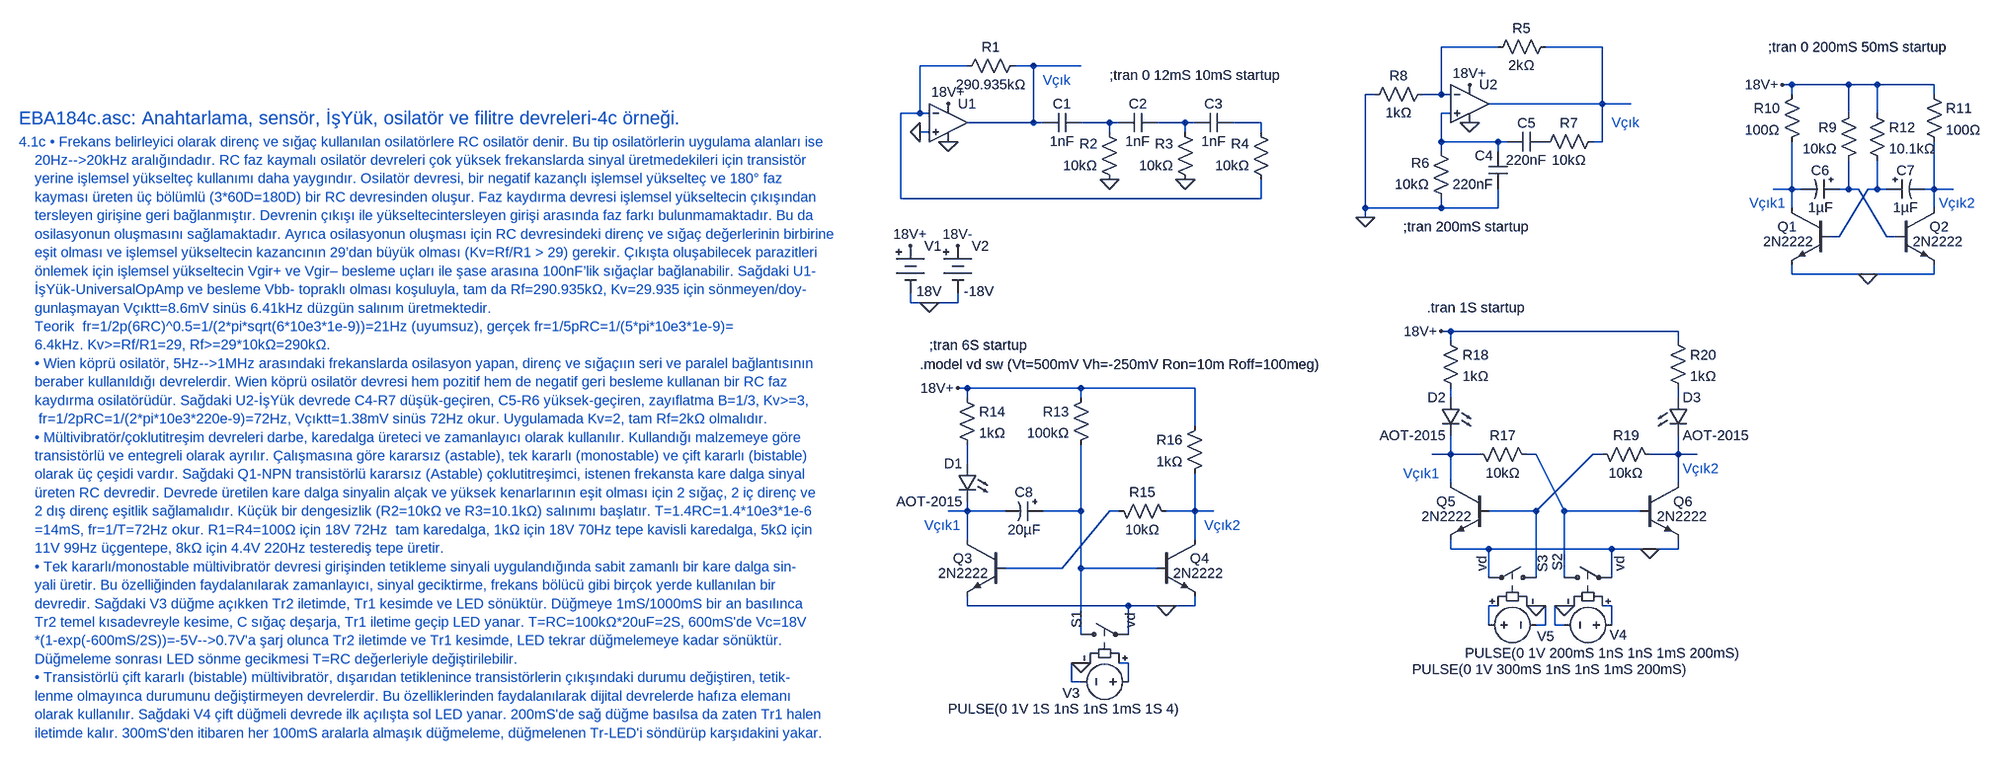
[diagram p0: schematic EBA184c.asc]
EBA184c.asc, the LTspice schematic file:
Version 4
SHEET 1 7064 4332
WIRE 2448 -64 2352 -64
WIRE 2624 -64 2528 -64
WIRE 1552 -32 1472 -32
WIRE 1664 -32 1632 -32
WIRE 1744 -32 1664 -32
WIRE 2944 0 2928 0
WIRE 3040 0 2944 0
WIRE 3088 0 3040 0
WIRE 3184 0 3088 0
WIRE 2240 16 2224 16
WIRE 2352 16 2352 -64
WIRE 2352 16 2320 16
WIRE 2368 16 2352 16
WIRE 2944 16 2944 0
WIRE 3184 16 3184 0
WIRE 2624 32 2624 -64
WIRE 2624 32 2432 32
WIRE 2672 32 2624 32
WIRE 1472 48 1472 -32
WIRE 1472 48 1440 48
WIRE 1488 48 1472 48
WIRE 2368 48 2352 48
WIRE 3040 48 3040 0
WIRE 3088 48 3088 0
WIRE 1664 64 1664 -32
WIRE 1664 64 1552 64
WIRE 1680 64 1664 64
WIRE 1792 64 1744 64
WIRE 1808 64 1792 64
WIRE 1920 64 1872 64
WIRE 1936 64 1920 64
WIRE 2048 64 2000 64
WIRE 1488 80 1472 80
WIRE 1792 80 1792 64
WIRE 1920 80 1920 64
WIRE 2048 80 2048 64
WIRE 2352 96 2352 48
WIRE 2448 96 2352 96
WIRE 2464 96 2448 96
WIRE 2624 96 2624 32
WIRE 2624 96 2608 96
WIRE 2352 112 2352 96
WIRE 2448 112 2448 96
WIRE 2944 176 2944 96
WIRE 2944 176 2912 176
WIRE 2960 176 2944 176
WIRE 3040 176 3040 128
WIRE 3040 176 3024 176
WIRE 3056 176 3040 176
WIRE 3088 176 3088 128
WIRE 3088 176 3072 176
WIRE 3104 176 3088 176
WIRE 3184 176 3184 96
WIRE 3184 176 3168 176
WIRE 3216 176 3184 176
WIRE 1440 192 1440 48
WIRE 2048 192 2048 160
WIRE 2048 192 1440 192
WIRE 2224 208 2224 16
WIRE 2352 208 2352 192
WIRE 2352 208 2224 208
WIRE 2448 208 2448 176
WIRE 2448 208 2352 208
WIRE 2944 208 2944 176
WIRE 3184 208 3184 176
WIRE 2224 224 2224 208
WIRE 3024 256 3072 176
WIRE 3024 256 3008 256
WIRE 3104 256 3056 176
WIRE 3120 256 3104 256
WIRE 2944 320 2944 304
WIRE 3072 320 2944 320
WIRE 3184 320 3184 304
WIRE 3184 320 3072 320
WIRE 1456 368 1456 352
WIRE 1488 368 1456 368
WIRE 1536 368 1536 352
WIRE 1536 368 1488 368
WIRE 2368 416 2352 416
WIRE 2752 416 2368 416
WIRE 2368 432 2368 416
WIRE 2752 432 2752 416
WIRE 1552 512 1536 512
WIRE 1744 512 1552 512
WIRE 1936 512 1744 512
WIRE 1552 528 1552 512
WIRE 1744 528 1744 512
WIRE 2368 528 2368 512
WIRE 2752 528 2752 512
WIRE 1936 576 1936 512
WIRE 2368 624 2368 592
WIRE 2368 624 2336 624
WIRE 2416 624 2368 624
WIRE 2512 624 2496 624
WIRE 2624 624 2608 624
WIRE 2752 624 2752 592
WIRE 2752 624 2704 624
WIRE 2784 624 2752 624
WIRE 1552 640 1552 608
WIRE 2368 672 2368 624
WIRE 2752 672 2752 624
WIRE 1552 720 1552 704
WIRE 1552 720 1520 720
WIRE 1616 720 1552 720
WIRE 1744 720 1744 608
WIRE 1744 720 1680 720
WIRE 1808 720 1792 720
WIRE 1936 720 1936 656
WIRE 1936 720 1888 720
WIRE 1968 720 1936 720
WIRE 2512 720 2608 624
WIRE 2512 720 2432 720
WIRE 2560 720 2512 624
WIRE 2688 720 2560 720
WIRE 1552 768 1552 720
WIRE 1936 768 1936 720
WIRE 2368 784 2368 768
WIRE 2432 784 2368 784
WIRE 2640 784 2432 784
WIRE 2704 784 2640 784
WIRE 2752 784 2752 768
WIRE 2752 784 2704 784
WIRE 1712 816 1792 720
WIRE 1712 816 1616 816
WIRE 1744 816 1744 720
WIRE 1872 816 1744 816
WIRE 2432 832 2432 784
WIRE 2512 832 2512 720
WIRE 2560 832 2560 720
WIRE 2640 832 2640 784
WIRE 1552 880 1552 864
WIRE 1824 880 1552 880
WIRE 1888 880 1824 880
WIRE 1936 880 1936 864
WIRE 1936 880 1888 880
WIRE 2448 880 2432 880
WIRE 2512 880 2496 880
WIRE 2528 880 2512 880
WIRE 2560 880 2544 880
WIRE 2576 880 2560 880
WIRE 2640 880 2624 880
WIRE 2432 912 2432 880
WIRE 2528 912 2528 880
WIRE 2528 912 2512 912
WIRE 2544 912 2544 880
WIRE 2560 912 2544 912
WIRE 2640 912 2640 880
WIRE 1744 928 1744 816
WIRE 1824 928 1824 880
WIRE 1744 976 1728 976
WIRE 1760 976 1744 976
WIRE 1824 976 1808 976
WIRE 1728 1008 1728 976
WIRE 1744 1008 1728 1008
WIRE 1824 1008 1824 976
FLAG 1456 272 18V+
FLAG 1488 368 0
FLAG 1536 272 18V-
FLAG 1520 32 18V+
FLAG 1472 80 0
FLAG 1920 160 0
FLAG 1792 160 0
FLAG 1520 96 0
FLAG 2400 0 18V+
FLAG 2224 224 0
FLAG 2400 64 0
FLAG 3072 320 0
FLAG 2928 0 18V+
FLAG 1744 976 0
FLAG 1888 880 0
FLAG 1536 512 18V+
FLAG 2560 880 0
FLAG 2704 784 0
FLAG 2512 880 0
FLAG 2352 416 18V+
SYMBOL Misc\\battery 1456 256 R0
WINDOW 3 10 93 Left 2
SYMATTR Value 18V
SYMATTR InstName V1
SYMBOL Misc\\battery 1536 256 R0
WINDOW 3 10 93 Left 2
SYMATTR Value -18V
SYMATTR InstName V2
SYMBOL res 1648 -48 R90
WINDOW 0 0 56 VBottom 2
WINDOW 3 32 56 VTop 2
SYMATTR InstName R1
SYMATTR Value 290.935kΩ
SYMBOL cap 1744 48 R90
WINDOW 0 0 32 VBottom 2
WINDOW 3 32 32 VTop 2
SYMATTR InstName C1
SYMATTR Value 1nF
SYMBOL res 1808 176 R180
WINDOW 0 36 76 Left 2
WINDOW 3 36 40 Left 2
SYMATTR InstName R2
SYMATTR Value 10kΩ
SYMBOL cap 1872 48 R90
WINDOW 0 0 32 VBottom 2
WINDOW 3 32 32 VTop 2
SYMATTR InstName C2
SYMATTR Value 1nF
SYMBOL res 1936 176 R180
WINDOW 0 36 76 Left 2
WINDOW 3 36 40 Left 2
SYMATTR InstName R3
SYMATTR Value 10kΩ
SYMBOL cap 2000 48 R90
WINDOW 0 0 32 VBottom 2
WINDOW 3 32 32 VTop 2
SYMATTR InstName C3
SYMATTR Value 1nF
SYMBOL res 2064 176 R180
WINDOW 0 36 76 Left 2
WINDOW 3 36 40 Left 2
SYMATTR InstName R4
SYMATTR Value 10kΩ
SYMBOL OpAmps\\UniversalOpAmp 1520 64 R0
SYMATTR InstName U1
SYMBOL res 2544 -80 R90
WINDOW 0 0 56 VBottom 2
WINDOW 3 32 56 VTop 2
SYMATTR InstName R5
SYMATTR Value 2kΩ
SYMBOL cap 2464 176 R180
WINDOW 0 24 56 Left 2
WINDOW 3 24 8 Left 2
SYMATTR InstName C4
SYMATTR Value 220nF
SYMBOL res 2368 208 R180
WINDOW 0 36 76 Left 2
WINDOW 3 36 40 Left 2
SYMATTR InstName R6
SYMATTR Value 10kΩ
SYMBOL cap 2528 80 R90
WINDOW 0 0 32 VBottom 2
WINDOW 3 32 32 VTop 2
SYMATTR InstName C5
SYMATTR Value 220nF
SYMBOL res 2512 112 R270
WINDOW 0 32 56 VTop 2
WINDOW 3 0 56 VBottom 2
SYMATTR InstName R7
SYMATTR Value 10kΩ
SYMBOL res 2224 32 R270
WINDOW 0 32 56 VTop 2
WINDOW 3 0 56 VBottom 2
SYMATTR InstName R8
SYMATTR Value 1kΩ
SYMBOL OpAmps\\UniversalOpAmp 2400 32 R0
SYMATTR InstName U2
SYMBOL npn 3008 208 M0
WINDOW 3 28 57 Left 2
SYMATTR Value 2N2222
SYMATTR InstName Q1
SYMBOL res 3056 32 M0
SYMATTR InstName R9
SYMATTR Value 10kΩ
SYMBOL polcap 3024 160 R90
WINDOW 0 0 32 VBottom 2
WINDOW 3 32 32 VTop 2
SYMATTR InstName C6
SYMATTR Value 1µF
SYMBOL res 2960 0 M0
SYMATTR InstName R10
SYMATTR Value 100Ω
SYMBOL npn 3120 208 R0
WINDOW 3 28 57 Left 2
SYMATTR Value 2N2222
SYMATTR InstName Q2
SYMBOL res 3168 0 R0
SYMATTR InstName R11
SYMATTR Value 100Ω
SYMBOL polcap 3104 160 M90
WINDOW 0 0 32 VBottom 2
WINDOW 3 32 32 VTop 2
SYMATTR InstName C7
SYMATTR Value 1µF
SYMBOL res 3072 32 R0
SYMATTR InstName R12
SYMATTR Value 10.1kΩ
SYMBOL npn 1616 768 M0
WINDOW 3 28 57 Left 2
SYMATTR Value 2N2222
SYMATTR InstName Q3
SYMBOL LED 1568 640 M0
SYMATTR InstName D1
SYMATTR Value AOT-2015
SYMATTR Description Diode
SYMATTR Type diode
SYMBOL res 1760 512 M0
SYMATTR InstName R13
SYMATTR Value 100kΩ
SYMBOL res 1536 512 R0
SYMATTR InstName R14
SYMATTR Value 1kΩ
SYMBOL npn 1872 768 R0
WINDOW 3 28 57 Left 2
SYMATTR Value 2N2222
SYMATTR InstName Q4
SYMBOL res 1904 736 M270
WINDOW 0 32 56 VTop 2
WINDOW 3 0 56 VBottom 2
SYMATTR InstName R15
SYMATTR Value 10kΩ
SYMBOL res 1952 560 M0
SYMATTR InstName R16
SYMATTR Value 1kΩ
SYMBOL sw 1728 928 R270
WINDOW 0 11 9 Left 2
WINDOW 3 10 100 Left 2
SYMATTR InstName S1
SYMATTR Value vd
SYMBOL voltage 1840 1008 R90
WINDOW 0 19 98 VRight 2
WINDOW 3 46 -71 VRight 2
WINDOW 123 0 0 Left 0
WINDOW 39 0 0 Left 0
SYMATTR InstName V3
SYMATTR Value PULSE(0 1V 1S 1nS 1nS 1mS 1S 4)
SYMBOL polcap 1680 704 R90
WINDOW 0 0 32 VBottom 2
WINDOW 3 32 32 VTop 2
SYMATTR InstName C8
SYMATTR Value 20µF
SYMBOL npn 2432 672 M0
WINDOW 3 28 57 Left 2
SYMATTR Value 2N2222
SYMATTR InstName Q5
SYMBOL LED 2384 528 M0
SYMATTR InstName D2
SYMATTR Value AOT-2015
SYMATTR Description Diode
SYMATTR Type diode
SYMBOL res 2512 640 M270
WINDOW 0 32 56 VTop 2
WINDOW 3 0 56 VBottom 2
SYMATTR InstName R17
SYMATTR Value 10kΩ
SYMBOL res 2352 416 R0
SYMATTR InstName R18
SYMATTR Value 1kΩ
SYMBOL npn 2688 672 R0
WINDOW 3 28 57 Left 2
SYMATTR Value 2N2222
SYMATTR InstName Q6
SYMBOL res 2720 640 M270
WINDOW 0 32 56 VTop 2
WINDOW 3 0 56 VBottom 2
SYMATTR InstName R19
SYMATTR Value 10kΩ
SYMBOL sw 2544 832 R270
WINDOW 0 11 5 Left 2
WINDOW 3 10 110 Left 2
SYMATTR InstName S2
SYMATTR Value vd
SYMBOL voltage 2656 912 R90
WINDOW 0 17 -10 VRight 2
WINDOW 3 48 -202 VRight 2
WINDOW 123 0 0 Left 0
WINDOW 39 0 0 Left 0
SYMATTR InstName V4
SYMATTR Value PULSE(0 1V 200mS 1nS 1nS 1mS 200mS)
SYMBOL LED 2736 528 R0
SYMATTR InstName D3
SYMATTR Value AOT-2015
SYMATTR Description Diode
SYMATTR Type diode
SYMBOL res 2736 416 R0
SYMATTR InstName R20
SYMATTR Value 1kΩ
SYMBOL sw 2528 832 M270
WINDOW 0 9 4 Left 2
WINDOW 3 10 107 Left 2
SYMATTR InstName S3
SYMATTR Value vd
SYMBOL voltage 2416 912 M90
WINDOW 0 19 98 VRight 2
WINDOW 3 75 -113 VRight 2
WINDOW 123 0 0 Left 0
WINDOW 39 0 0 Left 0
SYMATTR InstName V5
SYMATTR Value PULSE(0 1V 300mS 1nS 1nS 1mS 200mS)
TEXT -232 56 Left 3 ;EBA184c.asc: Anahtarlama, sensör, İşYük, osilatör ve filitre devreleri-4c örneği.
TEXT -232 96 Left 2 ;4.1c • Frekans belirleyici olarak direnç ve sığaç kullanılan osilatörlere RC osilatör denir. Bu tip osilatörlerin uygulama alanları ise\n    20Hz-->20kHz aralığındadır. RC faz kaymalı osilatör devreleri çok yüksek frekanslarda sinyal üretmedekileri için transistör \n    yerine işlemsel yükselteç kullanımı daha yaygındır. Osilatör devresi, bir negatif kazançlı işlemsel yükselteç ve 180° faz \n    kayması üreten üç bölümlü (3*60D=180D) bir RC devresinden oluşur. Faz kaydırma devresi işlemsel yükseltecin çıkışından \n    tersleyen girişine geri bağlanmıştır. Devrenin çıkışı ile yükseltecintersleyen girişi arasında faz farkı bulunmamaktadır. Bu da \n    osilasyonun oluşmasını sağlamaktadır. Ayrıca osilasyonun oluşması için RC devresindeki direnç ve sığaç değerlerinin birbirine\n    eşit olması ve işlemsel yükseltecin kazancının 29’dan büyük olması (Kv=Rf/R1 > 29) gerekir. Çıkışta oluşabilecek parazitleri\n    önlemek için işlemsel yükseltecin Vgir+ ve Vgir– besleme uçları ile şase arasına 100nF’lik sığaçlar bağlanabilir. Sağdaki U1-\n    İşYük-UniversalOpAmp ve besleme Vbb- topraklı olması koşuluyla, tam da Rf=290.935kΩ, Kv=29.935 için sönmeyen/doy-\n    gunlaşmayan Vçıktt=8.6mV sinüs 6.41kHz düzgün salınım üretmektedir.\n    Teorik  fr=1/2p(6RC)^0.5=1/(2*pi*sqrt(6*10e3*1e-9))=21Hz (uyumsuz), gerçek fr=1/5pRC=1/(5*pi*10e3*1e-9)=\n    6.4kHz. Kv>=Rf/R1=29, Rf>=29*10kΩ=290kΩ.\n    • Wien köprü osilatör, 5Hz-->1MHz arasındaki frekanslarda osilasyon yapan, direnç ve sığaçıın seri ve paralel bağlantısının \n    beraber kullanıldığı devrelerdir. Wien köprü osilatör devresi hem pozitif hem de negatif geri besleme kullanan bir RC faz\n    kaydırma osilatörüdür. Sağdaki U2-İşYük devrede C4-R7 düşük-geçiren, C5-R6 yüksek-geçiren, zayıflatma B=1/3, Kv>=3,\n     fr=1/2pRC=1/(2*pi*10e3*220e-9)=72Hz, Vçıktt=1.38mV sinüs 72Hz okur. Uygulamada Kv=2, tam Rf=2kΩ olmalıdır.\n    • Mültivibratör/çoklutitreşim devreleri darbe, karedalga üreteci ve zamanlayıcı olarak kullanılır. Kullandığı malzemeye göre \n    transistörlü ve entegreli olarak ayrılır. Çalışmasına göre kararsız (astable), tek kararlı (monostable) ve çift kararlı (bistable) \n    olarak üç çeşidi vardır. Sağdaki Q1-NPN transistörlü kararsız (Astable) çoklutitreşimci, istenen frekansta kare dalga sinyal \n    üreten RC devredir. Devrede üretilen kare dalga sinyalin alçak ve yüksek kenarlarının eşit olması için 2 sığaç, 2 iç direnç ve\n    2 dış direnç eşitlik sağlamalıdır. Küçük bir dengesizlik (R2=10kΩ ve R3=10.1kΩ) salınımı başlatır. T=1.4RC=1.4*10e3*1e-6\n    =14mS, fr=1/T=72Hz okur. R1=R4=100Ω için 18V 72Hz  tam karedalga, 1kΩ için 18V 70Hz tepe kavisli karedalga, 5kΩ için\n    11V 99Hz üçgentepe, 8kΩ için 4.4V 220Hz testerediş tepe üretir.\n    • Tek kararlı/monostable mültivibratör devresi girişinden tetikleme sinyali uygulandığında sabit zamanlı bir kare dalga sin-\n    yali üretir. Bu özelliğinden faydalanılarak zamanlayıcı, sinyal geciktirme, frekans bölücü gibi birçok yerde kullanılan bir \n    devredir. Sağdaki V3 düğme açıkken Tr2 iletimde, Tr1 kesimde ve LED sönüktür. Düğmeye 1mS/1000mS bir an basılınca\n    Tr2 temel kısadevreyle kesime, C sığaç deşarja, Tr1 iletime geçip LED yanar. T=RC=100kΩ*20uF=2S, 600mS'de Vc=18V\n    *(1-exp(-600mS/2S))=-5V-->0.7V'a şarj olunca Tr2 iletimde ve Tr1 kesimde, LED tekrar düğmelemeye kadar sönüktür. \n    Düğmeleme sonrası LED sönme gecikmesi T=RC değerleriyle değiştirilebilir.\n    • Transistörlü çift kararlı (bistable) mültivibratör, dışarıdan tetiklenince transistörlerin çıkışındaki durumu değiştiren, tetik-\n    lenme olmayınca durumunu değiştirmeyen devrelerdir. Bu özelliklerinden faydalanılarak dijital devrelerde hafıza elemanı \n    olarak kullanılır. Sağdaki V4 çift düğmeli devrede ilk açılışta sol LED yanar. 200mS'de sağ düğme basılsa da zaten Tr1 halen\n    iletimde kalır. 300mS'den itibaren her 100mS aralarla almaşık düğmeleme, düğmelenen Tr-LED'i söndürüp karşıdakini yakar.
TEXT 1680 -8 Left 2 ;Vçık
TEXT 1792 -16 Left 2 !;tran 0 12mS 10mS startup
TEXT 2640 64 Left 2 ;Vçık
TEXT 2288 240 Left 2 !;tran 200mS startup
TEXT 2904 -64 Left 2 !;tran 0 200mS 50mS startup
TEXT 2872 200 Left 2 ;Vçık1
TEXT 3192 200 Left 2 ;Vçık2
TEXT 1488 440 Left 2 !;tran 6S startup
TEXT 1480 744 Left 2 ;Vçık1
TEXT 1952 744 Left 2 ;Vçık2
TEXT 1472 472 Left 2 !.model vd sw (Vt=500mV Vh=-250mV Ron=10m Roff=100meg)
TEXT 2328 376 Left 2 !.tran 1S startup
TEXT 2288 656 Left 2 ;Vçık1
TEXT 2760 648 Left 2 ;Vçık2

The netlist it stands for:
* EBA184c.asc
V1 18V+ 0 18V
V2 18V- 0 -18V
R1 N004 N003 290.935kΩ
C1 N006 N004 1nF
R2 0 N006 10kΩ
C2 N007 N006 1nF
R3 0 N007 10kΩ
C3 N008 N007 1nF
R4 N003 N008 10kΩ
XU1 0 N003 18V+ 0 N004 level1 Avol=1Meg GBW=10Meg Vos=0 En=0 Enk=0 In=0 Ink=0 Rin=500Meg  ; pins In+ In- V+ V- OUT
R5 N002 N001 2kΩ
C4 0 N005 220nF
R6 0 N005 10kΩ
C5 P001 N005 220nF
R7 P001 N002 10kΩ
R8 0 N001 1kΩ
XU2 N005 N001 18V+ 0 N002 level1 Avol=1Meg GBW=10Meg Vos=0 En=0 Enk=0 In=0 Ink=0 Rin=500Meg  ; pins In+ In- V+ V- OUT
Q1 N009 N011 0 0 2N2222
R9 18V+ N010 10kΩ
C6 N010 N009 1µF
R10 18V+ N009 100Ω
Q2 N012 N010 0 0 2N2222
R11 18V+ N012 100Ω
C7 N011 N012 1µF
R12 18V+ N011 10.1kΩ
Q3 N020 N022 0 0 2N2222
D1 N019 N020 AOT-2015
R13 18V+ N021 100kΩ
R14 18V+ N019 1kΩ
Q4 N023 N021 0 0 2N2222
R15 N023 N022 10kΩ
R16 18V+ N023 1kΩ
S1 N021 0 N026 0 vd
V3 N026 0 PULSE(0 1V 1S 1nS 1nS 1mS 1S 4)
C8 N021 N020 20µF
Q5 N015 N017 0 0 2N2222
D2 N013 N015 AOT-2015
R17 N016 N015 10kΩ
R18 18V+ N013 1kΩ
Q6 N018 N016 0 0 2N2222
R19 N018 N017 10kΩ
S2 N016 0 N025 0 vd
V4 N025 0 PULSE(0 1V 200mS 1nS 1nS 1mS 200mS)
D3 N014 N018 AOT-2015
R20 18V+ N014 1kΩ
S3 N017 0 N024 0 vd
V5 N024 0 PULSE(0 1V 300mS 1nS 1nS 1mS 200mS)
.model D D
.lib standard.dio
.model NPN NPN
.model PNP PNP
.lib standard.bjt
* EBA184c.asc: Anahtarlama, sensör, İşYük, osilatör ve filitre devreleri-4c örneği.
* 4.1c • Frekans belirleyici olarak direnç ve sığaç kullanılan osilatörlere RC osilatör denir. Bu tip osilatörlerin uygulama alanları ise
*     20Hz-->20kHz aralığındadır. RC faz kaymalı osilatör devreleri çok yüksek frekanslarda sinyal üretmedekileri için transistör
*     yerine işlemsel yükselteç kullanımı daha yaygındır. Osilatör devresi, bir negatif kazançlı işlemsel yükselteç ve 180° faz
*     kayması üreten üç bölümlü (3*60D=180D) bir RC devresinden oluşur. Faz kaydırma devresi işlemsel yükseltecin çıkışından
*     tersleyen girişine geri bağlanmıştır. Devrenin çıkışı ile yükseltecintersleyen girişi arasında faz farkı bulunmamaktadır. Bu da
*     osilasyonun oluşmasını sağlamaktadır. Ayrıca osilasyonun oluşması için RC devresindeki direnç ve sığaç değerlerinin birbirine
*     eşit olması ve işlemsel yükseltecin kazancının 29’dan büyük olması (Kv=Rf/R1 > 29) gerekir. Çıkışta oluşabilecek parazitleri
*     önlemek için işlemsel yükseltecin Vgir+ ve Vgir– besleme uçları ile şase arasına 100nF’lik sığaçlar bağlanabilir. Sağdaki U1-
*     İşYük-UniversalOpAmp ve besleme Vbb- topraklı olması koşuluyla, tam da Rf=290.935kΩ, Kv=29.935 için sönmeyen/doy-
*     gunlaşmayan Vçıktt=8.6mV sinüs 6.41kHz düzgün salınım üretmektedir.
*     Teorik  fr=1/2p(6RC)^0.5=1/(2*pi*sqrt(6*10e3*1e-9))=21Hz (uyumsuz), gerçek fr=1/5pRC=1/(5*pi*10e3*1e-9)=
*     6.4kHz. Kv>=Rf/R1=29, Rf>=29*10kΩ=290kΩ.
*     • Wien köprü osilatör, 5Hz-->1MHz arasındaki frekanslarda osilasyon yapan, direnç ve sığaçıın seri ve paralel bağlantısının
*     beraber kullanıldığı devrelerdir. Wien köprü osilatör devresi hem pozitif hem de negatif geri besleme kullanan bir RC faz
*     kaydırma osilatörüdür. Sağdaki U2-İşYük devrede C4-R7 düşük-geçiren, C5-R6 yüksek-geçiren, zayıflatma B=1/3, Kv>=3,
*      fr=1/2pRC=1/(2*pi*10e3*220e-9)=72Hz, Vçıktt=1.38mV sinüs 72Hz okur. Uygulamada Kv=2, tam Rf=2kΩ olmalıdır.
*     • Mültivibratör/çoklutitreşim devreleri darbe, karedalga üreteci ve zamanlayıcı olarak kullanılır. Kullandığı malzemeye göre
*     transistörlü ve entegreli olarak ayrılır. Çalışmasına göre kararsız (astable), tek kararlı (monostable) ve çift kararlı (bistable)
*     olarak üç çeşidi vardır. Sağdaki Q1-NPN transistörlü kararsız (Astable) çoklutitreşimci, istenen frekansta kare dalga sinyal
*     üreten RC devredir. Devrede üretilen kare dalga sinyalin alçak ve yüksek kenarlarının eşit olması için 2 sığaç, 2 iç direnç ve
*     2 dış direnç eşitlik sağlamalıdır. Küçük bir dengesizlik (R2=10kΩ ve R3=10.1kΩ) salınımı başlatır. T=1.4RC=1.4*10e3*1e-6
*     =14mS, fr=1/T=72Hz okur. R1=R4=100Ω için 18V 72Hz  tam karedalga, 1kΩ için 18V 70Hz tepe kavisli karedalga, 5kΩ için
*     11V 99Hz üçgentepe, 8kΩ için 4.4V 220Hz testerediş tepe üretir.
*     • Tek kararlı/monostable mültivibratör devresi girişinden tetikleme sinyali uygulandığında sabit zamanlı bir kare dalga sin-
*     yali üretir. Bu özelliğinden faydalanılarak zamanlayıcı, sinyal geciktirme, frekans bölücü gibi birçok yerde kullanılan bir
*     devredir. Sağdaki V3 düğme açıkken Tr2 iletimde, Tr1 kesimde ve LED sönüktür. Düğmeye 1mS/1000mS bir an basılınca
*     Tr2 temel kısadevreyle kesime, C sığaç deşarja, Tr1 iletime geçip LED yanar. T=RC=100kΩ*20uF=2S, 600mS'de Vc=18V
*     *(1-exp(-600mS/2S))=-5V-->0.7V'a şarj olunca Tr2 iletimde ve Tr1 kesimde, LED tekrar düğmelemeye kadar sönüktür.
*     Düğmeleme sonrası LED sönme gecikmesi T=RC değerleriyle değiştirilebilir.
*     • Transistörlü çift kararlı (bistable) mültivibratör, dışarıdan tetiklenince transistörlerin çıkışındaki durumu değiştiren, tetik-
*     lenme olmayınca durumunu değiştirmeyen devrelerdir. Bu özelliklerinden faydalanılarak dijital devrelerde hafıza elemanı
*     olarak kullanılır. Sağdaki V4 çift düğmeli devrede ilk açılışta sol LED yanar. 200mS'de sağ düğme basılsa da zaten Tr1 halen
*     iletimde kalır. 300mS'den itibaren her 100mS aralarla almaşık düğmeleme, düğmelenen Tr-LED'i söndürüp karşıdakini yakar.
* Vçık
;tran 0 12mS 10mS startup
* Vçık
;tran 200mS startup
;tran 0 200mS 50mS startup
* Vçık1
* Vçık2
;tran 6S startup
* Vçık1
* Vçık2
.model vd sw (Vt=500mV Vh=-250mV Ron=10m Roff=100meg)
.tran 1S startup
* Vçık1
* Vçık2
.lib UniversalOpAmp1.lib
.backanno
.end